# Altium schematic sheet nixieBoards.SchDoc
size A
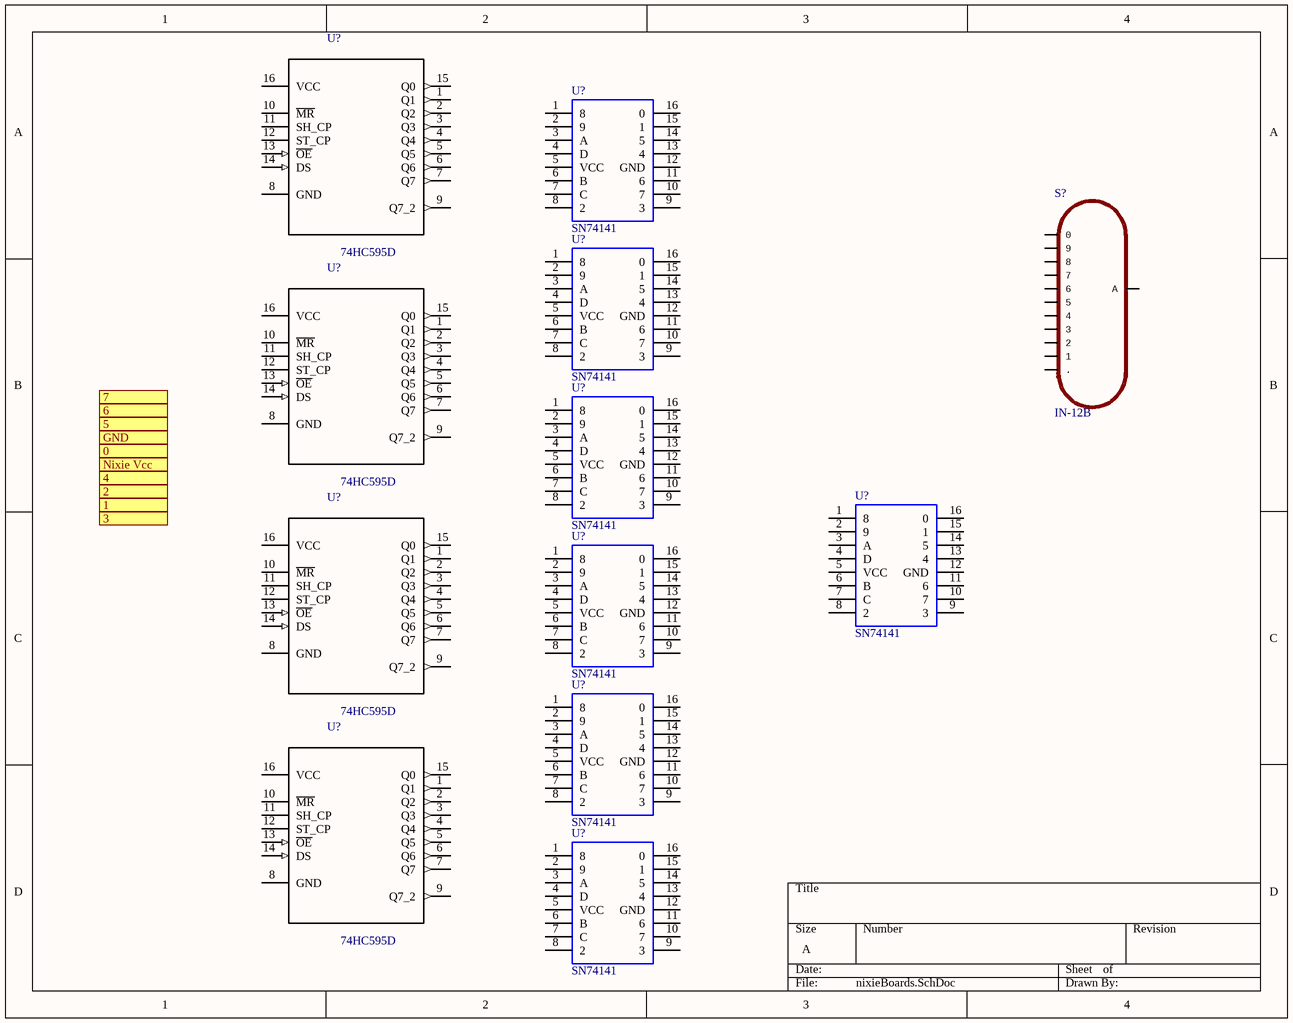
[diagram p0: nixieBoards.SchDoc]

## Parts
(Parts that share a designator on the sheet are numbered #1, #2 ... from top to bottom, then left to right.)
S?  IN-12B  [IN-12]
U?#1  SN74141  [CircuitWorks-DIP16]
U?#2  74HC595D  [SOIC127P600X175-16N]
U?#3  SN74141  [CircuitWorks-DIP16]
U?#4  74HC595D  [SOIC127P600X175-16N]
U?#5  SN74141  [CircuitWorks-DIP16]
U?#6  SN74141  [CircuitWorks-DIP16]
U?#7  SN74141  [CircuitWorks-DIP16]
U?#8  74HC595D  [SOIC127P600X175-16N]
U?#9  SN74141  [CircuitWorks-DIP16]
U?#10  74HC595D  [SOIC127P600X175-16N]
U?#11  SN74141  [CircuitWorks-DIP16]

## Ports
0, 1, 2, 3, 4, 5, 6, 7, GND, Nixie Vcc

## Nets

Not connected (* = marked no-connect by the designer): S? 0(2) 1(A) 2(0) 3(9) 4(8) 5(7) 6 7(5) 8(4) 9(3) A(1) LHDP(.); U?#1 1(8) 2(9) 3(A) 4(D) 5(VCC) 6(B) 7(C) 8(2) 9(3) 10(7) 11(6) 12(GND) 13(4) 14(5) 15(1) 16(0); U?#2 1(Q1) 2(Q2) 3(Q3) 4(Q4) 5(Q5) 6(Q6) 7(Q7) 8(GND) 9(Q7_2) 10(~{MR}) 11(SH_CP) 12(ST_CP) 13(~{OE}) 14(DS) 15(Q0) 16(VCC); U?#3 1(8) 2(9) 3(A) 4(D) 5(VCC) 6(B) 7(C) 8(2) 9(3) 10(7) 11(6) 12(GND) 13(4) 14(5) 15(1) 16(0); U?#4 1(Q1) 2(Q2) 3(Q3) 4(Q4) 5(Q5) 6(Q6) 7(Q7) 8(GND) 9(Q7_2) 10(~{MR}) 11(SH_CP) 12(ST_CP) 13(~{OE}) 14(DS) 15(Q0) 16(VCC); U?#5 1(8) 2(9) 3(A) 4(D) 5(VCC) 6(B) 7(C) 8(2) 9(3) 10(7) 11(6) 12(GND) 13(4) 14(5) 15(1) 16(0); U?#6 1(8) 2(9) 3(A) 4(D) 5(VCC) 6(B) 7(C) 8(2) 9(3) 10(7) 11(6) 12(GND) 13(4) 14(5) 15(1) 16(0); U?#7 1(8) 2(9) 3(A) 4(D) 5(VCC) 6(B) 7(C) 8(2) 9(3) 10(7) 11(6) 12(GND) 13(4) 14(5) 15(1) 16(0); U?#8 1(Q1) 2(Q2) 3(Q3) 4(Q4) 5(Q5) 6(Q6) 7(Q7) 8(GND) 9(Q7_2) 10(~{MR}) 11(SH_CP) 12(ST_CP) 13(~{OE}) 14(DS) 15(Q0) 16(VCC); U?#9 1(8) 2(9) 3(A) 4(D) 5(VCC) 6(B) 7(C) 8(2) 9(3) 10(7) 11(6) 12(GND) 13(4) 14(5) 15(1) 16(0); U?#10 1(Q1) 2(Q2) 3(Q3) 4(Q4) 5(Q5) 6(Q6) 7(Q7) 8(GND) 9(Q7_2) 10(~{MR}) 11(SH_CP) 12(ST_CP) 13(~{OE}) 14(DS) 15(Q0) 16(VCC); U?#11 1(8) 2(9) 3(A) 4(D) 5(VCC) 6(B) 7(C) 8(2) 9(3) 10(7) 11(6) 12(GND) 13(4) 14(5) 15(1) 16(0)

## Library data of the parts
U?#2 U?#4 U?#8 U?#10 = 74HC595D: Shift Register Single 8-Bit Serial to Serial/Parallel 16-Pin SO; MF: Toshiba; Price: None; MP: 74HC595D; SnapEDA_Link: https://www.snapeda.com/parts/74HC595D/Toshiba%20Semiconductor%20and%20Storage/view-part/?ref=snap; Package: SOIC-16 NXP Semiconductors; Availability: Unavailable; Value: *